# Altium schematic sheet harmonicAnalyzer_r002.SchDoc
size A4
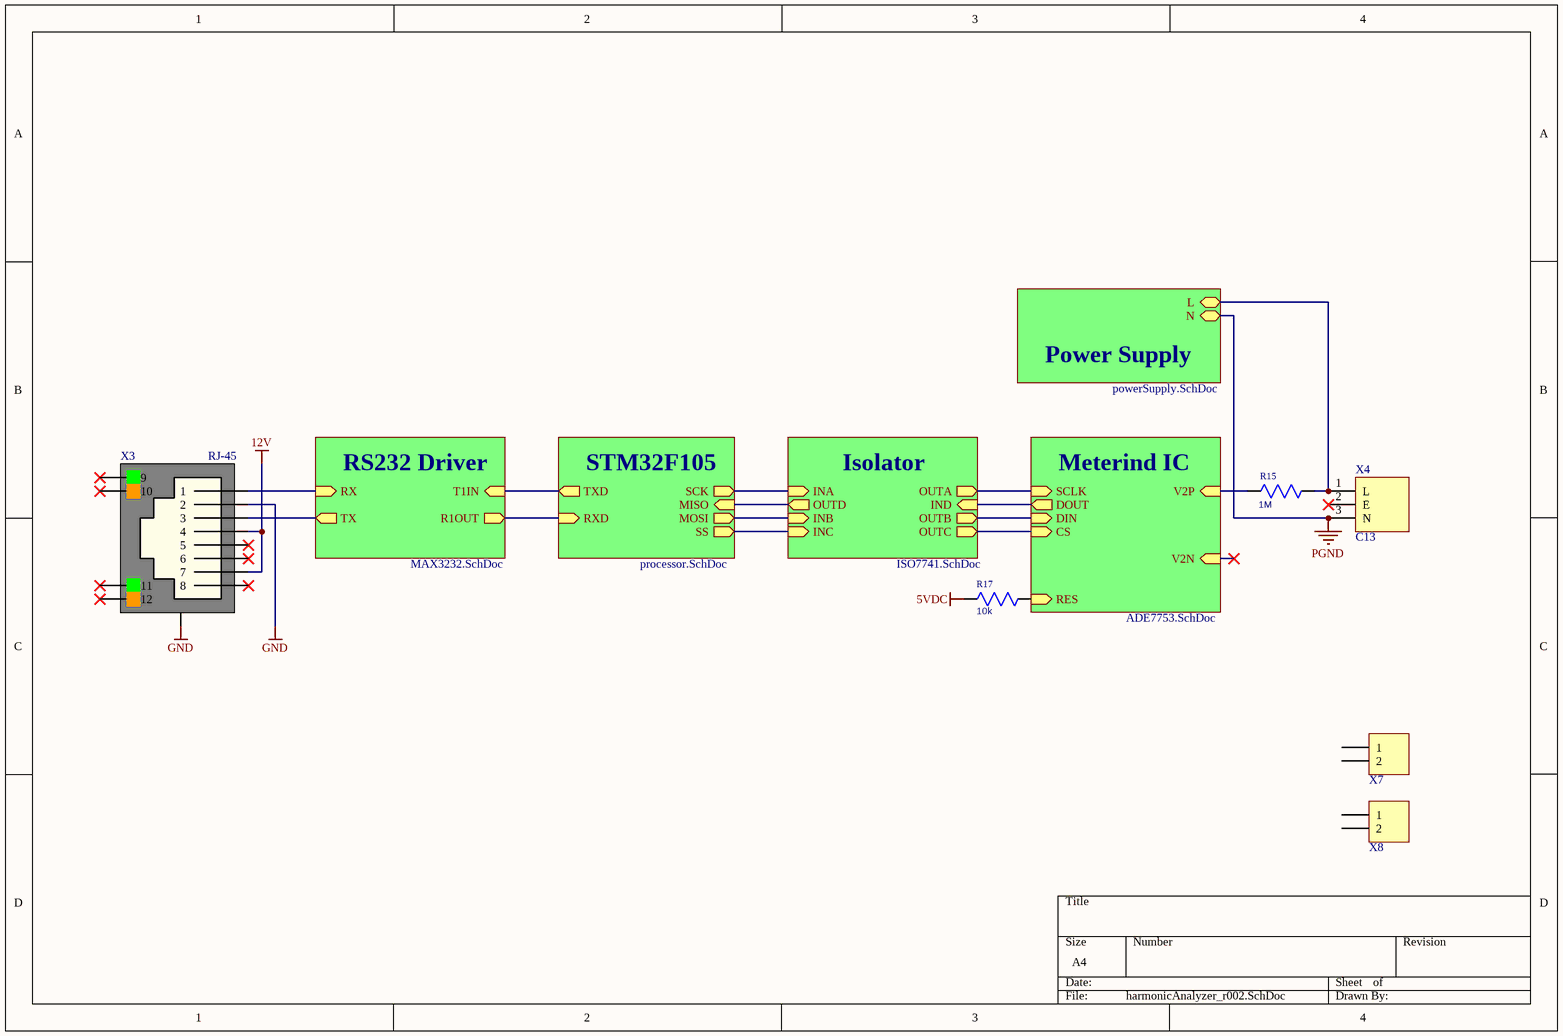
[diagram p0: harmonicAnalyzer_r002.SchDoc]

## Parts
R15  1M  [R_0805]
R17  10k  [R_0603]
X3  RJ-45  [RJHSE-5E8X]
X4  C13  [C13_RA_TH]
X7  PBS-2  [PBS-2-3D]  (value not drawn)
X8  PBS-2  [PBS-2-3D]  (value not drawn)

## Sub-sheets
Isolator = ISO7741.SchDoc: OUTC (out), IND (in), INC (in), OUTD (out), INA (in), OUTB (out), OUTA (out), INB (in)
Meterind IC = ADE7753.SchDoc: DOUT (out), CS (in), V2N (in), V2P (in), DIN (in), RES (in), SCLK (in)
Power Supply = powerSupply.SchDoc: N (bidir), L (bidir)
RS232 Driver = MAX3232.SchDoc: T1IN (in), RX (in), TX (out), R1OUT (out)
STM32F105 = processor.SchDoc: MOSI (out), SS (out), MISO (in), RXD (in), SCK (out), TXD (out)

## Nets
5VDC: R17.1
12V: X3.4 X3.7
GND: X3.2 X3.13
PGND: X4.3(N) ; sheet Power Supply/N
NetR15_1: R15.1 ; sheet Meterind IC/V2P
NetR15_2: R15.2 X4.1(L) ; sheet Power Supply/L
NetR17_2: R17.2 ; sheet Meterind IC/RES
NetX3_1: X3.1 ; sheet RS232 Driver/RX
NetX3_3: X3.3 ; sheet RS232 Driver/TX
(unnamed): sheet RS232 Driver/T1IN, sheet STM32F105/TXD
(unnamed): sheet RS232 Driver/R1OUT, sheet STM32F105/RXD
(unnamed): sheet STM32F105/MOSI, sheet Isolator/INB
(unnamed): sheet STM32F105/SS, sheet Isolator/INC
(unnamed): sheet STM32F105/MISO, sheet Isolator/OUTD
(unnamed): sheet STM32F105/SCK, sheet Isolator/INA
(unnamed): sheet Isolator/OUTC, sheet Meterind IC/CS
(unnamed): sheet Isolator/IND, sheet Meterind IC/DOUT
(unnamed): sheet Isolator/OUTB, sheet Meterind IC/DIN
(unnamed): sheet Isolator/OUTA, sheet Meterind IC/SCLK

Not connected (* = marked no-connect by the designer): X3 5* 6* 8* 9* 10* 11* 12*; X4 2(E)*; X7 1 2; X8 1 2

## Library data of the parts
R15 = R0805: Resistor; Value: 1M
R17 = R0603: Resistor; Value: 10k
X3 = RJ-45: Jack Modular Connector
X7 X8 = PBS-2: Header, 2-Pin; LatestRevisionDate: 17-Jul-2002; LatestRevisionNote: Re-released for DXP Platform.; Publisher: Altium Limited